# Altium schematic sheet ControlTop.SchDoc
size A4; SheetNumber: 2; SheetTotal: 8
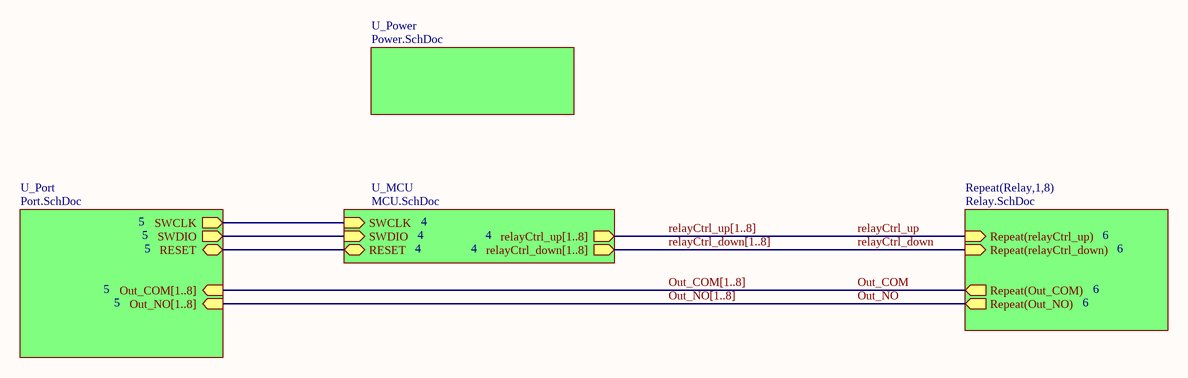
[diagram p0: ControlTop.SchDoc]

## Sub-sheets
Repeat(Relay,1,8) = Relay.SchDoc: Repeat(Out_COM) (out), Repeat(Out_NO) (out), Repeat(relayCtrl_up) (in), Repeat(relayCtrl_down) (in)
U_MCU = MCU.SchDoc: SWDIO (in), SWCLK (in), RESET (bidir), relayCtrl_up[1..8] (out), relayCtrl_down[1..8] (out)
U_Port = Port.SchDoc: SWCLK (out), SWDIO (out), RESET (bidir), Out_NO[1..8] (in), Out_COM[1..8] (in)
U_Power = Power.SchDoc: no entries

## Nets
Out_COM: sheet Repeat(Relay,1,8)/Repeat(Out_COM)
Out_NO: sheet Repeat(Relay,1,8)/Repeat(Out_NO)
relayCtrl_down: sheet Repeat(Relay,1,8)/Repeat(relayCtrl_down)
relayCtrl_up: sheet Repeat(Relay,1,8)/Repeat(relayCtrl_up)
(unnamed): sheet U_MCU/SWDIO, sheet U_Port/SWDIO
(unnamed): sheet U_MCU/SWCLK, sheet U_Port/SWCLK
(unnamed): sheet U_MCU/RESET, sheet U_Port/RESET

## Buses and harness runs
bus Out_COM[1..8] = sheet U_Port/Out_COM[1..8]
bus Out_NO[1..8] = sheet U_Port/Out_NO[1..8]
bus relayCtrl_down[1..8] = sheet U_MCU/relayCtrl_down[1..8]
bus relayCtrl_up[1..8] = sheet U_MCU/relayCtrl_up[1..8]